# EAGLE schematic Esp32IoAdapt (EAGLE 9.6.2)
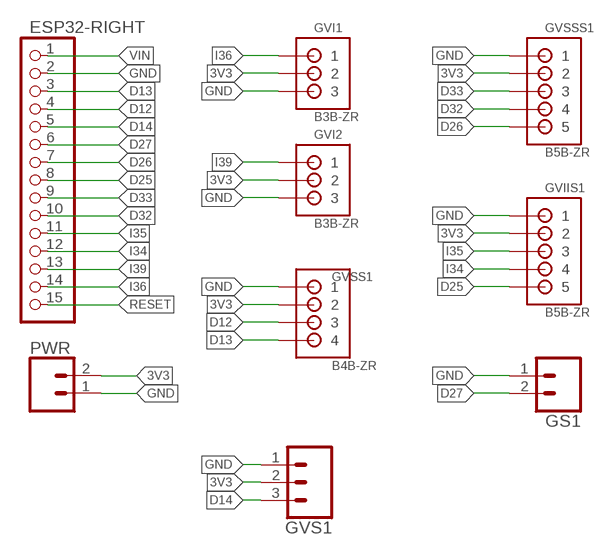
[diagram p0: schematic, sheet 1]

## Parts
ESP32-RIGHT  0  PINHD-1X15  [1X15]
GS1  CONN_02  [1X02]
GVI1  B3B-ZR  [B3B-ZR]
GVI2  B3B-ZR  [B3B-ZR]
GVIIS1  B5B-ZR  [B5B-ZR]
GVS1  CONN_03  [1X03]
GVSS1  B4B-ZR  [B4B-ZR]
GVSSS1  B5B-ZR  [B5B-ZR]
PWR  CONN_02  [1X02]

## Nets
3V3: GVI1.2 GVI2.2 GVIIS1.2 GVS1.2 GVSS1.2 GVSSS1.2 PWR.2
D12: ESP32-RIGHT.4 GVSS1.3
D13: ESP32-RIGHT.3 GVSS1.4
D14: ESP32-RIGHT.5 GVS1.3
D25: ESP32-RIGHT.8 GVIIS1.5
D26: ESP32-RIGHT.7 GVSSS1.5
D27: ESP32-RIGHT.6 GS1.2
D32: ESP32-RIGHT.10 GVSSS1.4
D33: ESP32-RIGHT.9 GVSSS1.3
GND: ESP32-RIGHT.2 GS1.1 GVI1.3 GVI2.3 GVIIS1.1 GVS1.1 GVSS1.1 GVSSS1.1 PWR.1
I34: ESP32-RIGHT.12 GVIIS1.4
I35: ESP32-RIGHT.11 GVIIS1.3
I36: ESP32-RIGHT.14 GVI1.1
I39: ESP32-RIGHT.13 GVI2.1
RESET: ESP32-RIGHT.15
VIN: ESP32-RIGHT.1

## Library data of the parts
ESP32-RIGHT = pinhead:PINHD-1X15: PIN HEADER
GS1 PWR = SparkFun-Connectors:CONN_02: Multi connection point. Often used as Generic Header-pin footprint for 0.1 inch spaced/style header connections On any of the 0.1 inch spaced packages, you can populate with these: Break Away Headers - Straight <https://www.sparkfun.com/products/116> (PRT-00116) Break Away Male Headers - Right Angle <https://www.sparkfun.com/products/553> (PRT-00553) Female Headers <https://www.sparkfun.com/products/115> (PRT-00115) Break Away Headers - Machine Pin <https://www.sparkfun.com/products/117> (PRT-00117) Break Away Female Headers - Swiss Machine Pin <https://www.sparkfun.com/products/743> (PRT-00743) For SCREWTERMINALS and SPRING TERMINALS visit here: Screw Terimnals on SparkFun.com <https://www.sparkfun.com/search/results?term=Screw+Terminals> (5mm/3.5mm/2.54mm spacing) This device is also useful as a general connection point to wire up your design to another part of your project. Our various solder wires solder well into these plated through hole pads. Hook-Up Wire - Assortment (Stranded, 22 AWG) <https://www.sparkfun.com/products/11375> (PRT-11375) Hook-Up Wire - Assortment (Solid Core, 22 AWG) <https://www.sparkfun.com/products/11367> (PRT-11367) View the entire wire category on our website here <https://www.sparkfun.com/categories/141> Special notes: Molex polarized connector foot print use with: PRT-08233 with associated crimp pins and housings. 2.54_SCREWTERM for use with PRT-10571. 3.5mm Screw Terminal footprints for PRT-08084 5mm Screw Terminal footprints for use with PRT-08432
GVI1 GVI2 = jst:B3B-ZR: JST-ZH Connector 3 pol, 1.5mm pitch Package: B3B-ZR Source: http://www.jst-mfg.com/product/pdf/eng/eZH.pdf
GVIIS1 GVSSS1 = jst:B5B-ZR: JST-ZH Connector 5 pol, 1.5mm pitch Package: B5B-ZR Source: http://www.jst-mfg.com/product/pdf/eng/eZH.pdf
GVS1 = SparkFun-Connectors:CONN_03: Multi connection point. Often used as Generic Header-pin footprint for 0.1 inch spaced/style header connections On any of the 0.1 inch spaced packages, you can populate with these: Break Away Headers - Straight <https://www.sparkfun.com/products/116> (PRT-00116) Break Away Male Headers - Right Angle <https://www.sparkfun.com/products/553> (PRT-00553) Female Headers <https://www.sparkfun.com/products/115> (PRT-00115) Break Away Headers - Machine Pin <https://www.sparkfun.com/products/117> (PRT-00117) Break Away Female Headers - Swiss Machine Pin <https://www.sparkfun.com/products/743> (PRT-00743) Stackable Header - 3 Pin (Female, 0.1") <https://www.sparkfun.com/products/13875> (PRT-13875) For SCREWTERMINALS and SPRING TERMINALS visit here: Screw Terimnals on SparkFun.com <https://www.sparkfun.com/search/results?term=Screw+Terminals> (5mm/3.5mm/2.54mm spacing) This device is also useful as a general connection point to wire up your design to another part of your project. Our various solder wires solder well into these plated through hole pads. Hook-Up Wire - Assortment (Stranded, 22 AWG) <https://www.sparkfun.com/products/11375> (PRT-11375) Hook-Up Wire - Assortment (Solid Core, 22 AWG) <https://www.sparkfun.com/products/11367> (PRT-11367) View the entire wire category on our website here <https://www.sparkfun.com/categories/141> Special notes: Molex polarized connector foot print use with SKU : PRT-08232 with associated crimp pins and housings.
GVSS1 = jst:B4B-ZR: JST-ZH Connector 4 pol, 1.5mm pitch Package: B4B-ZR Source: http://www.jst-mfg.com/product/pdf/eng/eZH.pdf